# EAGLE design BMS_Master_RevB3 (EAGLE 6.2)

## Sheet 1 of 4
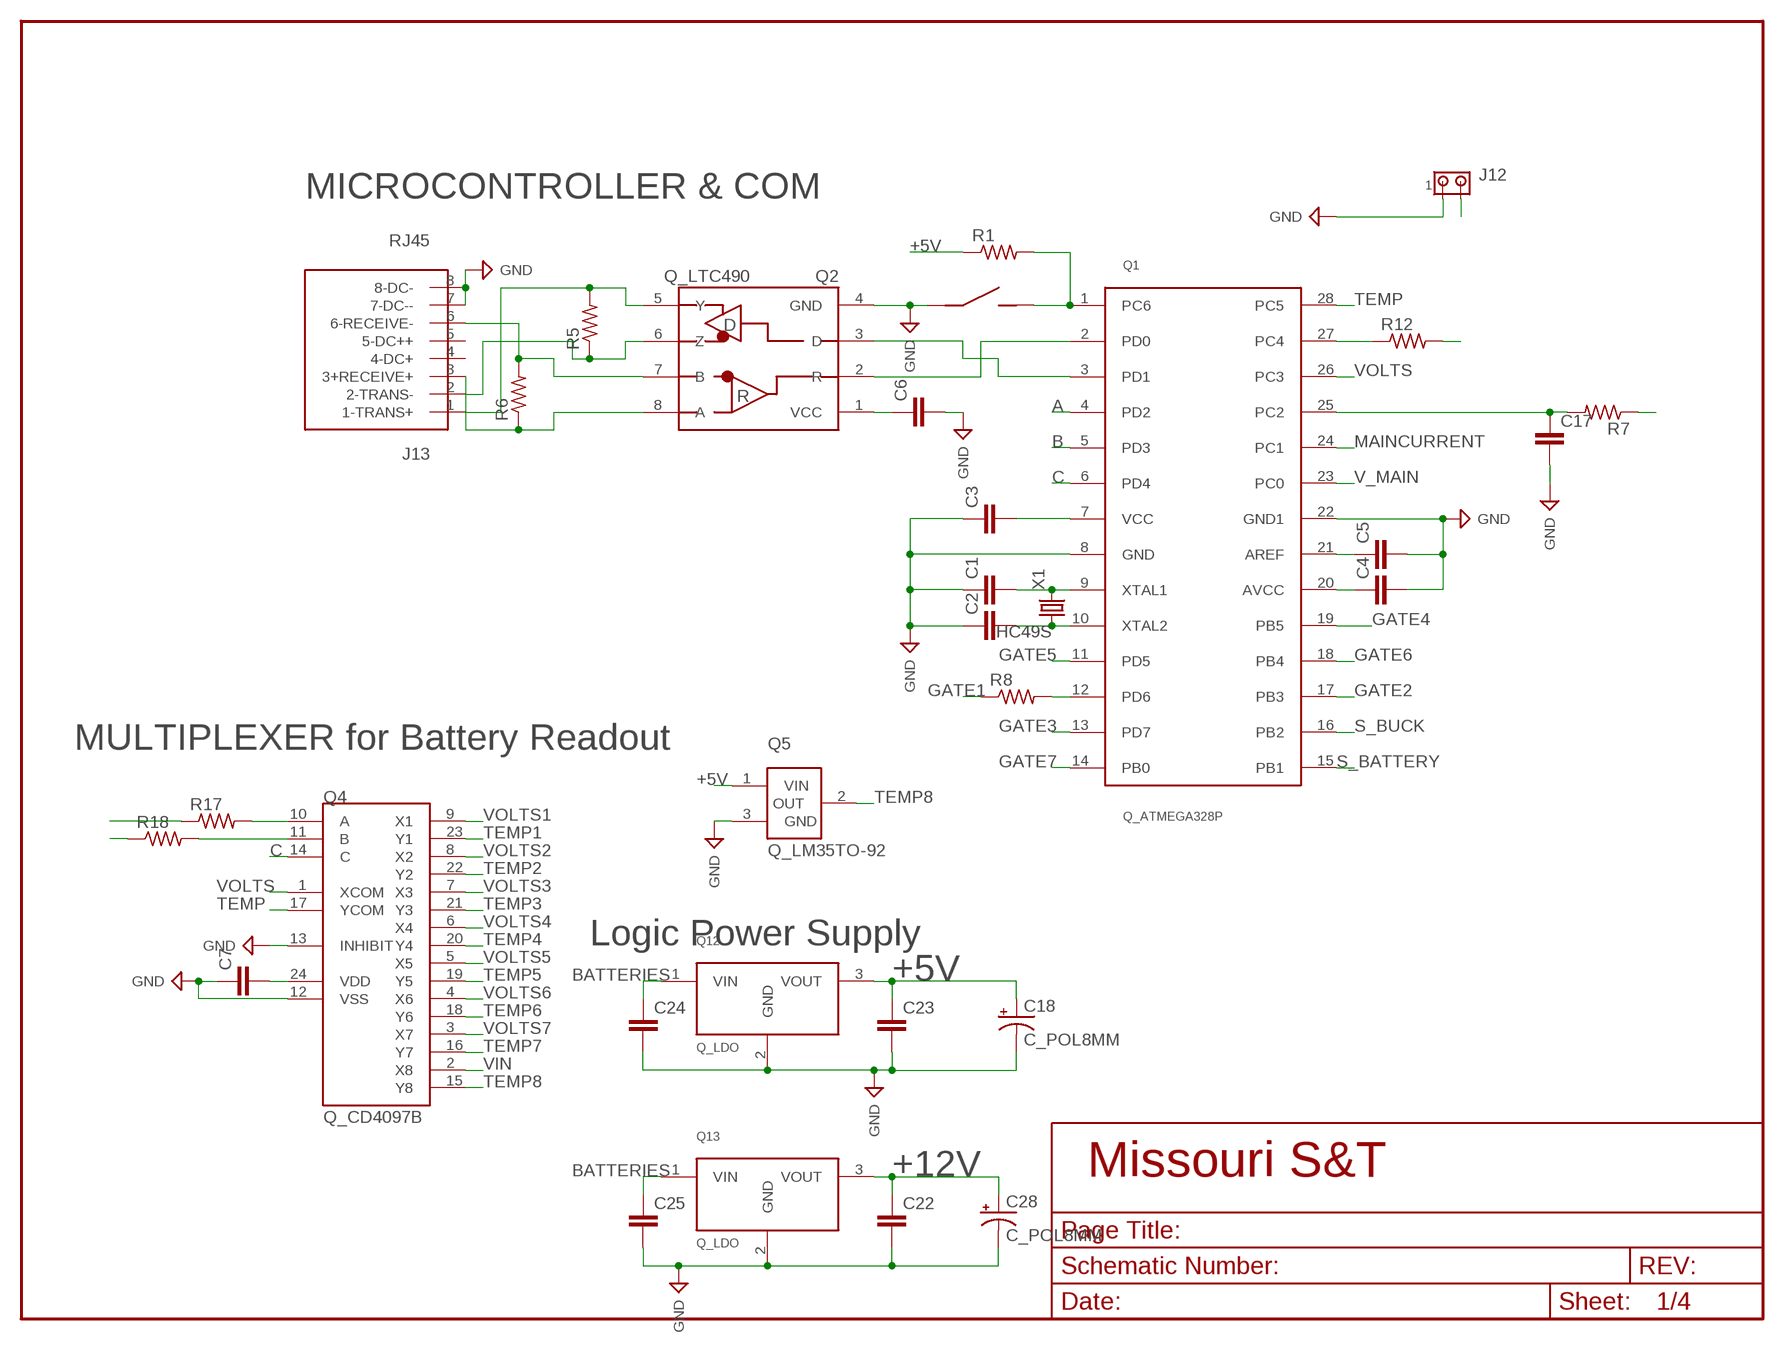
[diagram p0: schematic, sheet 1]

### Parts
C1  C_CAP_1206  [C_1206]
C2  C_CAP_1206  [C_1206]
C3  C_CAP_1206  [C_1206]
C4  C_CAP_1206  [C_1206]
C5  C_CAP_1206  [C_1206]
C6  C_CAP_1206  [C_1206]
C7  C_CAP_1206  [C_1206]
C17  C_CAP_1206  [C_1206]
C18  C_POL8MM  [C_8MM]
C22  C_CAP_1206  [C_1206]
C23  C_CAP_1206  [C_1206]
C24  C_CAP_1206  [C_1206]
C25  C_CAP_1206  [C_1206]
C28  C_POL8MM  [C_8MM]
J1  J_MC32857  [J_TOGGLE]
J12  J_MTA2P_100  [J_MTA100_2P]
J13  RJ45  [RJ45-CAT5E]
Q1  Q_ATMEGA328P  [DIP28]
Q2  Q_LTC490  [DIP8]
Q4  Q_CD4097B  Q_CD4067BRIGHT  [WDIP24]
Q5  Q_LM35TO-92  [TO-92-3]
Q12  Q_LDO  [TO-220]
Q13  Q_LDO  [TO-220]
R1  R_RES_1206  [R_1206]
R5  R_RES_1206  [R_1206]
R6  R_RES_1206  [R_1206]
R7  R_1/4W  [R_1/4W]
R8  R_1/4W  [R_1/4W]
R12  R_RES_0805  [R_0805]
R17  R_1/4W  [R_1/4W]
R18  R_1/4W  [R_1/4W]
X1  HC49S  X_HC49SCRYSTAL  [HC-49]

### Nets
+5V: C3.2 C4.1 C6.1 C7.2 C18.+ C23.1 Q1.7(VCC) Q1.20(AVCC) Q2.1(VCC) Q4.24(VDD) Q5.1(VIN) Q12.3(VOUT) R1.1 R12.2 ; also sheet 2,3
+12V: C22.1 C28.+ Q13.3(VOUT) ; also sheet 3,4
A: Q1.4(PD2) R17.1
B: Q1.5(PD3) R18.1
BATTERIES: C24.1 C25.1 Q12.1(VIN) Q13.1(VIN) ; also sheet 4
C: Q1.6(PD4) Q4.14(C)
CURRENT: R7.1 ; also sheet 3
GATE1: R8.1 ; also sheet 2
GATE2: Q1.17(PB3) ; also sheet 2
GATE3: Q1.13(PD7) ; also sheet 2
GATE4: Q1.19(PB5) ; also sheet 2
GATE5: Q1.11(PD5) ; also sheet 2
GATE6: Q1.18(PB4) ; also sheet 2
GATE7: Q1.14(PB0) ; also sheet 2
GND: C1.1 C2.1 C3.1 C4.2 C5.2 C6.2 C7.1 C17.2 C18.- C22.2 C23.2 C24.2 C25.2 C28.- J1.P$1 J12.1 J13.7(7-DC--) J13.8(8-DC-) Q1.8(GND) Q1.22(GND1) Q2.4(GND) Q4.12(VSS) Q4.13(INHIBIT) Q5.3(GND) Q12.2(GND) Q13.2(GND) ; supply symbol labelled SUP_GND ; also sheet 2,3,4
MAINCURRENT: Q1.24(PC1) ; also sheet 4
N$2: C2.2 Q1.10(XTAL2) X1.P$1
N$3: C1.2 Q1.9(XTAL1) X1.P$2
N$5: Q4.10(A) R17.2
N$6: C5.1 Q1.21(AREF)
N$7: Q4.11(B) R18.2
N$8: J1.P$2 Q1.1(PC6) R1.2
N$15: C17.1 Q1.25(PC2) R7.2
N$16: Q1.12(PD6) R8.2
N$21: Q1.2(PD0) Q2.2(R)
N$22: Q1.3(PD1) Q2.3(D)
N$32: J13.1(1-TRANS+) Q2.5(Y) R5.2
N$33: J13.2(2-TRANS-) Q2.6(Z) R5.1
N$36: J13.6(6-RECEIVE-) Q2.7(B) R6.2
N$37: J13.3(3+RECEIVE+) Q2.8(A) R6.1
PANIC: J12.2 Q1.27(PC4) R12.1
S_BATTERY: Q1.15(PB1) ; also sheet 4
S_BUCK: Q1.16(PB2) ; also sheet 3
TEMP: Q1.28(PC5) Q4.17(YCOM)
TEMP1: Q4.23(Y1) ; also sheet 2
TEMP2: Q4.22(Y2) ; also sheet 2
TEMP3: Q4.21(Y3) ; also sheet 2
TEMP4: Q4.20(Y4) ; also sheet 2
TEMP5: Q4.19(Y5) ; also sheet 2
TEMP6: Q4.18(Y6) ; also sheet 2
TEMP7: Q4.16(Y7) ; also sheet 2
TEMP8: Q4.15(Y8) Q5.2(OUT)
V_MAIN: Q1.23(PC0) ; also sheet 3
VIN: Q4.2(X8) ; also sheet 3
VOLTS: Q1.26(PC3) Q4.1(XCOM)
VOLTS1: Q4.9(X1) ; also sheet 2
VOLTS2: Q4.8(X2) ; also sheet 2
VOLTS3: Q4.7(X3) ; also sheet 2
VOLTS4: Q4.6(X4) ; also sheet 2
VOLTS5: Q4.5(X5) ; also sheet 2
VOLTS6: Q4.4(X6) ; also sheet 2
VOLTS7: Q4.3(X7) ; also sheet 2
Unconnected: J13.4(4-DC+) J13.5(5-DC++)

### Notes on the sheet
- MICROCONTROLLER & COM
- MULTIPLEXER for Battery Readout
- Logic Power Supply

## Sheet 2 of 4
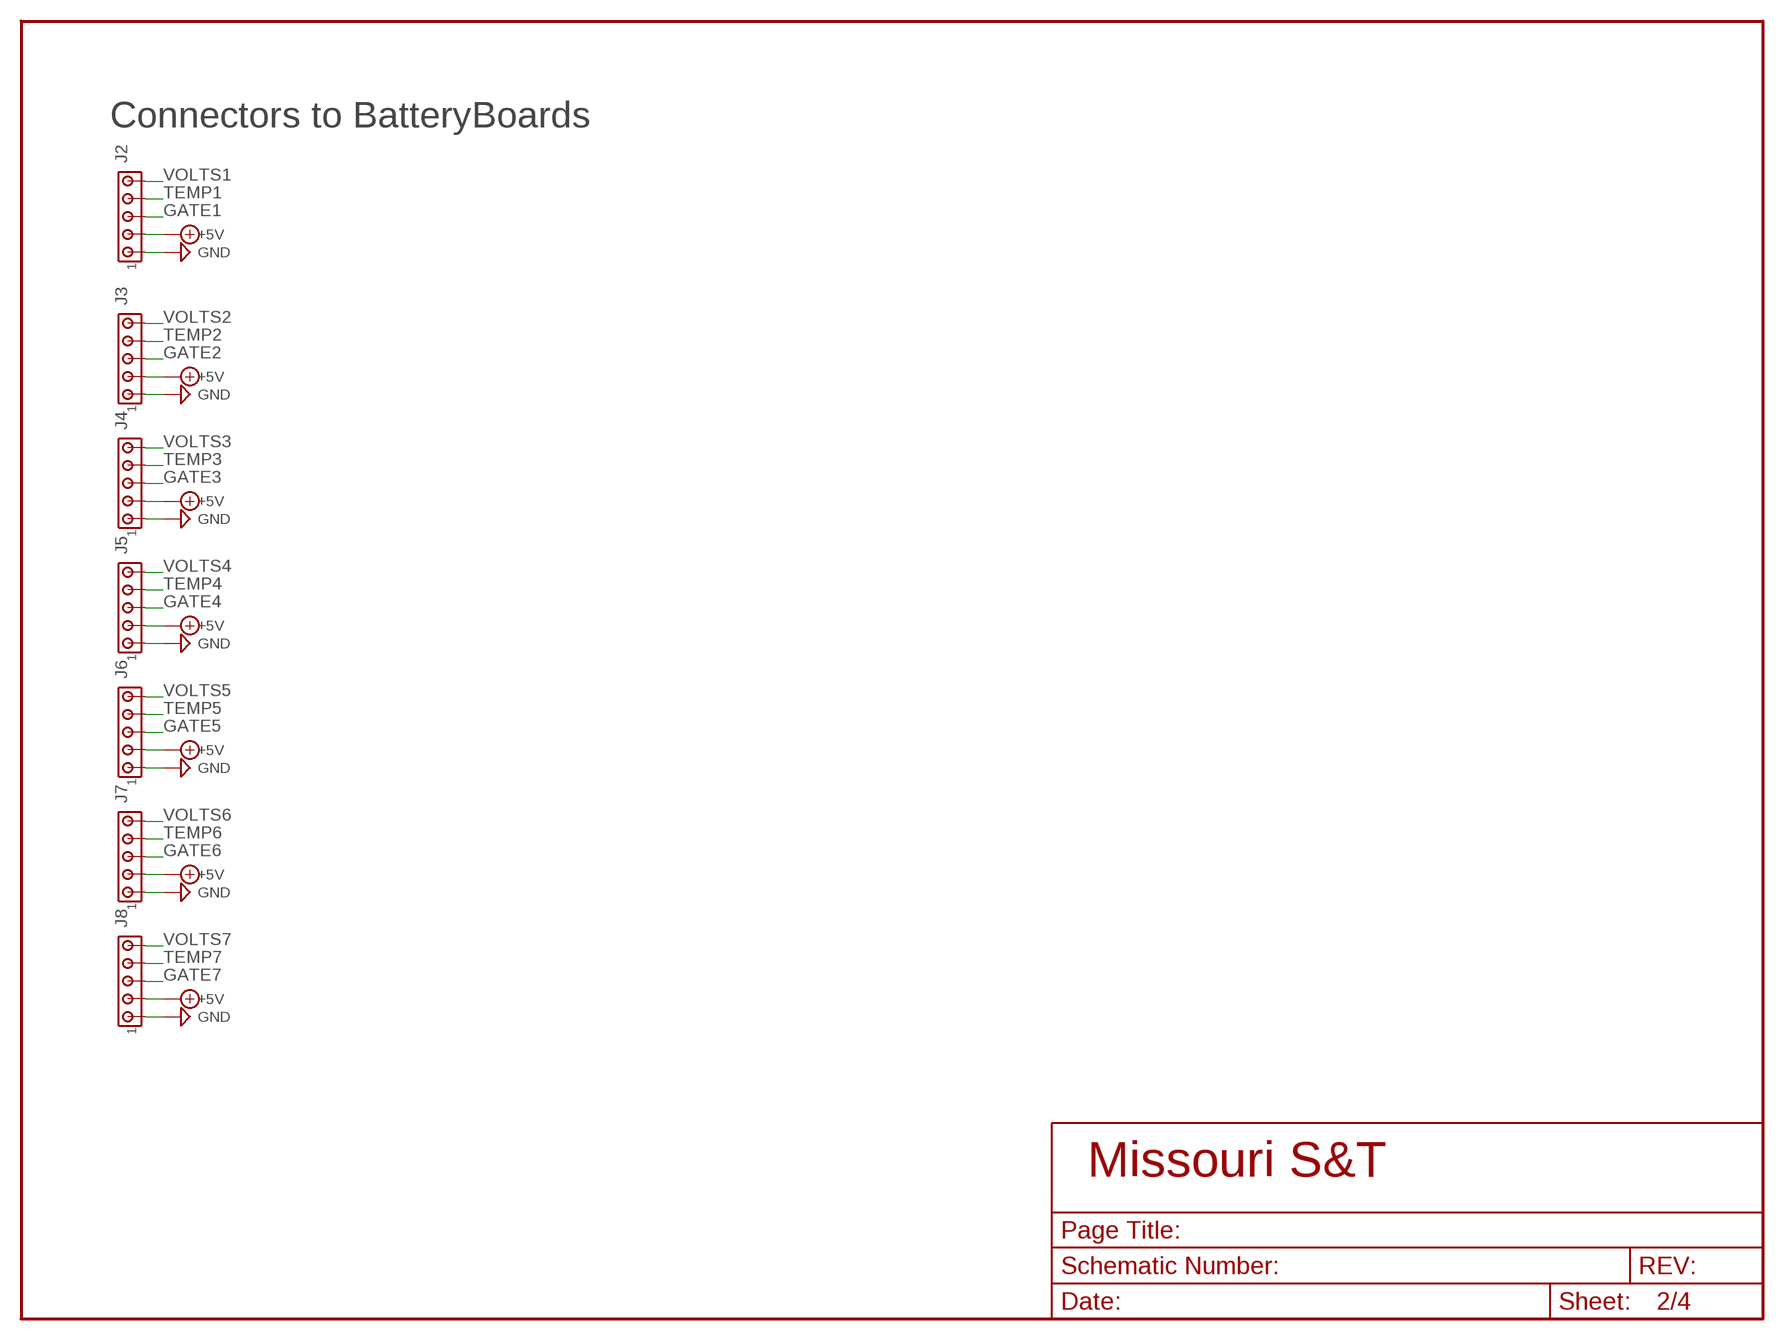
[diagram p1: schematic, sheet 2]

### Parts
J2  J_MTA5P_100  [J_MTA100_5P]
J3  J_MTA5P_100  [J_MTA100_5P]
J4  J_MTA5P_100  [J_MTA100_5P]
J5  J_MTA5P_100  [J_MTA100_5P]
J6  J_MTA5P_100  [J_MTA100_5P]
J7  J_MTA5P_100  [J_MTA100_5P]
J8  J_MTA5P_100  [J_MTA100_5P]

### Nets
+5V: J2.2 J3.2 J4.2 J5.2 J6.2 J7.2 J8.2 ; supply symbol labelled SUP_+5V ; also sheet 1,3
GATE1: J2.3 ; also sheet 1
GATE2: J3.3 ; also sheet 1
GATE3: J4.3 ; also sheet 1
GATE4: J5.3 ; also sheet 1
GATE5: J6.3 ; also sheet 1
GATE6: J7.3 ; also sheet 1
GATE7: J8.3 ; also sheet 1
GND: J2.1 J3.1 J4.1 J5.1 J6.1 J7.1 J8.1 ; supply symbol labelled SUP_GND ; also sheet 1,3,4
TEMP1: J2.4 ; also sheet 1
TEMP2: J3.4 ; also sheet 1
TEMP3: J4.4 ; also sheet 1
TEMP4: J5.4 ; also sheet 1
TEMP5: J6.4 ; also sheet 1
TEMP6: J7.4 ; also sheet 1
TEMP7: J8.4 ; also sheet 1
VOLTS1: J2.5 ; also sheet 1
VOLTS2: J3.5 ; also sheet 1
VOLTS3: J4.5 ; also sheet 1
VOLTS4: J5.5 ; also sheet 1
VOLTS5: J6.5 ; also sheet 1
VOLTS6: J7.5 ; also sheet 1
VOLTS7: J8.5 ; also sheet 1

### Notes on the sheet
- Connectors to BatteryBoards

## Sheet 3 of 4
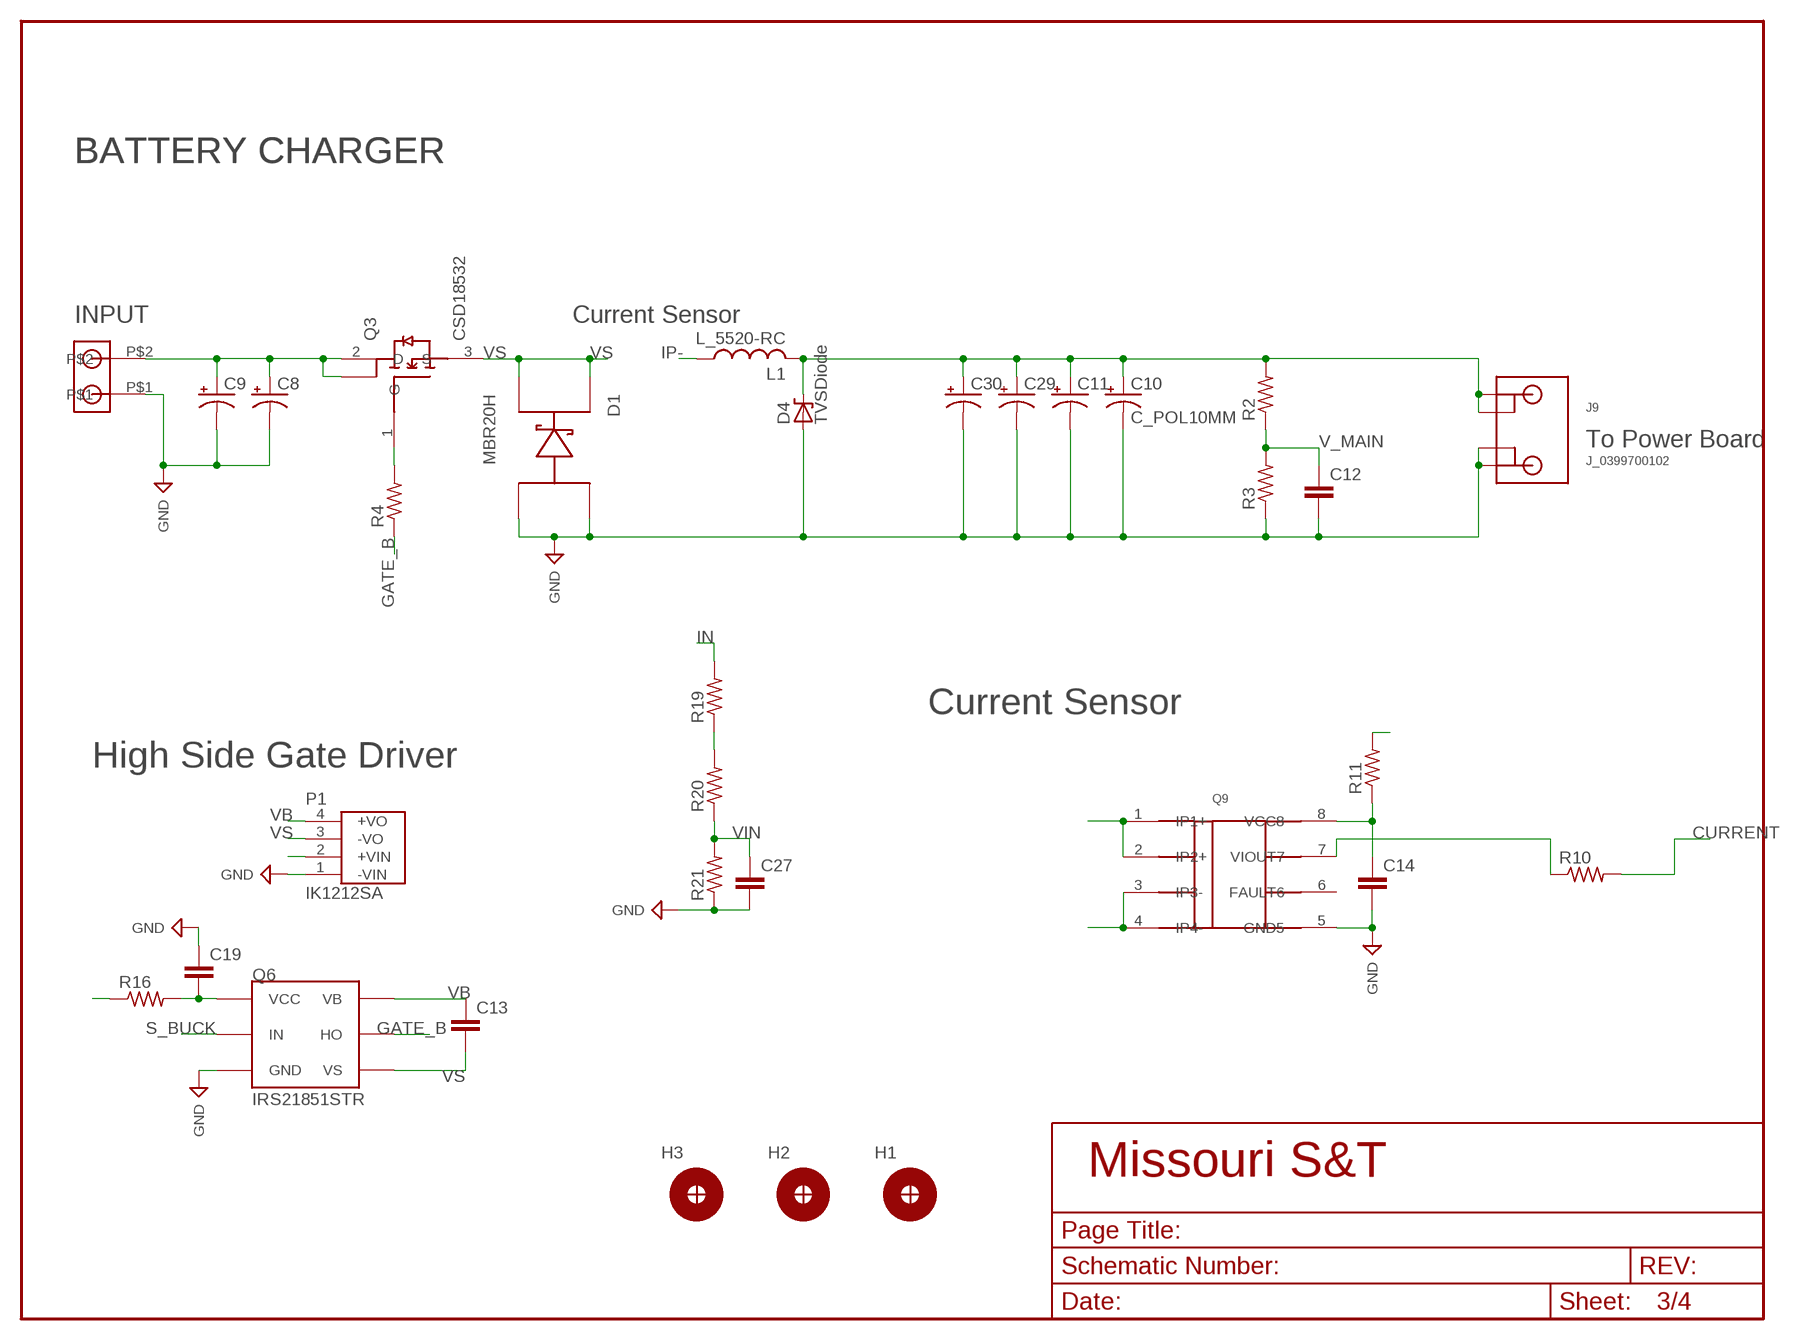
[diagram p2: schematic, sheet 3]

### Parts
C8  C_POL10MM  [C_10MM]
C9  C_POL10MM  [C_10MM]
C10  C_POL10MM  [C_10MM]
C11  C_POL10MM  [C_10MM]
C12  C_CAP_1206  [C_1206]
C13  C_CAP_1206  [C_1206]
C14  C_CAP_1206  [C_1206]
C19  C_CAP_1206  [C_1206]
C27  C_CAP_1206  [C_1206]
C29  C_POL10MM  [C_10MM]
C30  C_POL10MM  [C_10MM]
D1  MBR20H  D_MBR20H150CTG  [TO-220-FLAT]
D4  TVSDiode  D_1.5KE480A_D3.5MM_LS15.24MM  [DIODE_D3.5MM_LS15.24MM]
H1  H_MNTHOLE_#6  [H_MNTHOLE_#6]
H2  H_MNTHOLE_#6  [H_MNTHOLE_#6]
H3  H_MNTHOLE_#6  [H_MNTHOLE_#6]
J9  J_0399700102  [J_2CONHC]
J10  J_1546074-2  [THERM_BLOCK_2]
L1  L_5520-RC  [L_5520-RC]
P1  IK1212SA  TME1215S  [TME1215S]
Q3  CSD18532  Q_CSD18532KCSPCB  [TO-220-FLAT]
Q6  IRS21851STR  Q_IRS21851STR  [SOIC8]
Q9  Q_SO8ACS711  [Q_SO8]
R2  R_1/4W  [R_1/4W]
R3  R_RES_1206  [R_1206]
R4  R_RES_1206  [R_1206]
R10  R_1/4W  [R_1/4W]
R11  R_1/4W  [R_1/4W]
R16  R_1/4W  [R_1/4W]
R19  R_1/4W  [R_1/4W]
R20  R_1/4W  [R_1/4W]
R21  R_RES_1206  [R_1206]

### Nets
+5V: R11.2 ; also sheet 1,2
+5V1: C14.1 Q9.8(VCC8) R11.1 ; also sheet 4
+12V: R16.1 ; also sheet 1,4
+12V1: C19.2 P1.2(+VIN) Q6.1(VCC) R16.2
CURRENT: R10.2 ; also sheet 1
GATE_B: Q6.7(HO) R4.1
GND: C8.P$2(-) C9.P$2(-) C10.P$2(-) C11.P$2(-) C12.2 C14.2 C19.1 C27.2 C29.P$2(-) C30.P$2(-) D1.1(A1) D1.3(A2) D4.A J9.PIN2-1(2-1) J9.PIN2-2(2-2) J10.P$1 P1.1(-VIN) Q6.4(GND) Q9.5(GND5) R3.1 R21.1 ; supply symbol labelled SUP_GND ; also sheet 1,2,4
IN: C8.P$1(+) C9.P$1(+) J10.P$2 Q3.2(D) Q3.4 R19.2
IP-: L1.1 Q9.1(IP1+) Q9.2(IP2+)
MAIN: C10.P$1(+) C11.P$1(+) C29.P$1(+) C30.P$1(+) D4.C(K) J9.PIN1-1(1-1) J9.PIN1-2(1-2) L1.2 R2.2 ; also sheet 4
N$9: Q9.7(VIOUT7) R10.1
N$11: R19.1 R20.2
N$31: Q3.1(G) R4.2
S_BUCK: Q6.2(IN) ; also sheet 1
V_MAIN: C12.1 R2.1 R3.2 ; also sheet 1
VB: C13.1 P1.4(+VO) Q6.8(VB)
VIN: C27.1 R20.1 R21.2 ; also sheet 1
VS: C13.2 D1.2(C1) D1.4(C2) P1.3(-VO) Q3.3(S) Q6.6(VS) Q9.3(IP3-) Q9.4(IP4-)
Unconnected: H1.1 H2.1 H3.1 Q9.6(FAULT6)

### Notes on the sheet
- BATTERY CHARGER | BATTERY CHARGER
- INPUT | Current Sensor
- To Power Board
- Current Sensor
- High Side Gate Driver

## Sheet 4 of 4
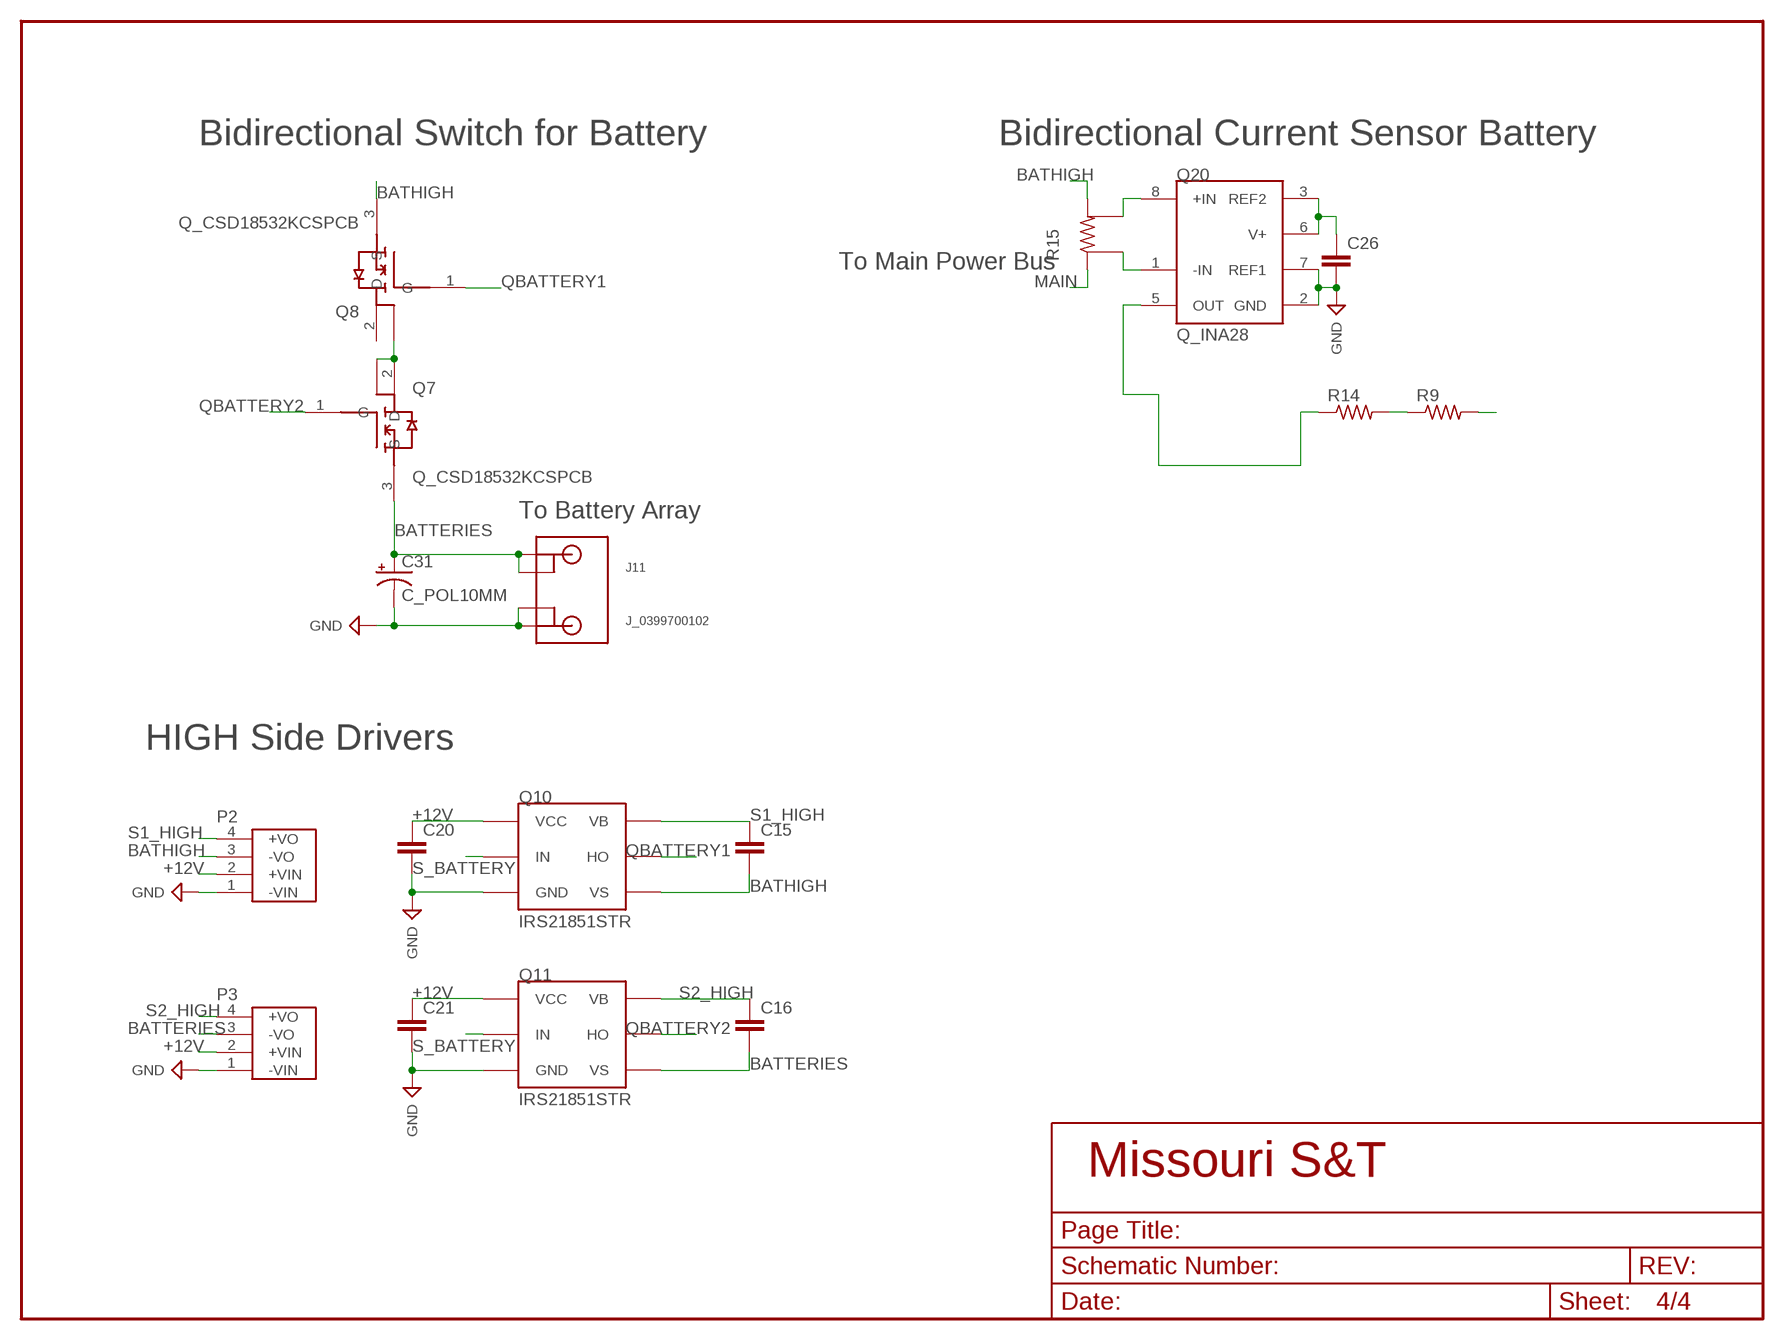
[diagram p3: schematic, sheet 4]

### Parts
C15  C_CAP_1206  [C_1206]
C16  C_CAP_1206  [C_1206]
C20  C_CAP_1206  [C_1206]
C21  C_CAP_1206  [C_1206]
C26  C_CAP_1206  [C_1206]
C31  C_POL10MM  [C_10MM]
J11  J_0399700102  [J_2CONHC]
P2  TME1215S  [TME1215S]
P3  TME1215S  [TME1215S]
Q7  Q_CSD18532KCSPCB  [TO-220-FLAT]
Q8  Q_CSD18532KCSPCB  [TO-220-FLAT]
Q10  IRS21851STR  Q_IRS21851STR  [SOIC8]
Q11  IRS21851STR  Q_IRS21851STR  [SOIC8]
Q20  Q_INA28  [SOIC8]
R9  R_1/4W  [R_1/4W]
R14  R_1/4W  [R_1/4W]
R15  R_FC4L110R001JER  [R_FC4L]

### Nets
+5V1: C26.1 Q20.3(REF2) Q20.6(V+) ; also sheet 3
+12V: C20.1 C21.1 P2.2(+VIN) P3.2(+VIN) Q10.1(VCC) Q11.1(VCC) ; also sheet 1,3
BATHIGH: C15.2 P2.3(-VO) Q8.3(S) Q10.6(VS) R15.2
BATTERIES: C16.2 C31.P$1(+) J11.PIN1-1(1-1) J11.PIN1-2(1-2) P3.3(-VO) Q7.3(S) Q11.6(VS) ; also sheet 1
GND: C20.2 C21.2 C26.2 C31.P$2(-) J11.PIN2-1(2-1) J11.PIN2-2(2-2) P2.1(-VIN) P3.1(-VIN) Q10.4(GND) Q11.4(GND) Q20.2(GND) Q20.7(REF1) ; supply symbol labelled SUP_GND ; also sheet 1,2,3
INT_BAT: Q7.2(D) Q7.4 Q8.4
MAIN: R15.1 ; also sheet 3
MAINCURRENT: R9.2 ; also sheet 1
N$4: Q20.5(OUT) R14.1
N$12: Q20.8(+IN) R15.SENSE2
N$13: Q20.1(-IN) R15.SENSE1
N$14: R9.1 R14.2
QBATTERY1: Q8.1(G) Q10.7(HO)
QBATTERY2: Q7.1(G) Q11.7(HO)
S1_HIGH: C15.1 P2.4(+VO) Q10.8(VB)
S2_HIGH: C16.1 P3.4(+VO) Q11.8(VB)
S_BATTERY: Q10.2(IN) Q11.2(IN) ; also sheet 1
Unconnected: Q8.2(D)

### Notes on the sheet
- Bidirectional Switch for Battery | Bidirectional Current Sensor Battery
- To Main Power Bus
- To Battery Array
- HIGH Side Drivers

## Library data of the parts
C1-C7 C12-C17 C19-C27 = Lib_Passive:C_CAP
C8-C11 C18 C28-C31 = PCB0M1:C_POL: Alum Elect. Cap with 10mm diameter, 5mm lead spacing and 0.7mm lead diameter
D1 = PCB0M1:D_MBR20H150CTG: 150V 20A Schottky Diode TO-220 Flat Mounted
D4 = Lib_Katlyn:D_1.5KE480A: Zener Diode
H1-H3 = Lib_TH:H_MNTHOLE
J1 = PCB0M1:J_MC32857: SWITCH, TACTILE, SPST-NO, 50mA, THD
J2-J8 = Lib_TH:J_MTA5P
J9 J11 = PCB0M1:J_0399700102: High Current Power Connector
J10 = PCB0M1:J_1546074-2
J12 = Lib_TH:J_MTA2P
J13 = PCB0M1:RJ45
L1 = PCB0M1:L_5520-RC: 100uH 10A Inductor
P1-P3 = SCC Fib:TME1215S
Q1 = PCB0M1:Q_ATMEGA328P: ATMEGA 328P in 28PIN PDIP package
Q2 = PCB0M1:Q_LTC490: IC, RS422-RS485 DRVR
Q3 Q7 Q8 = PCB0M1:Q_CSD18532KCS: 60V 100A N Channel MOSFET
Q4 = PCB0M1:Q_CD4067B: Differential 8:1 Multiplexer
Q5 = PCB0M1:Q_LM35: IC, TEMPERATURE SENSOR, 0.4°C, TO-92-3
Q6 Q10 Q11 = PCB0M1:Q_IRS21851STR: 4A 600V 130ns High Side Driver
Q9 = Lib_MPPT:Q_SO8
Q12 Q13 = PCB0M1:Q_LDO: LDO with fixed ouput voltage
Q20 = PCB0M1:Q_INA28: 10Khz Bidirectional Current Sense Amplifier
R1 R3 R12 R21 = Lib_Passive:R_RES
R2 R7-R11 R14 R16-R20 = Lib_TH:R
R4-R6 = Lib_Passive - Copy:R_RES
R15 = PCB0M1:R_FC4L110R001JER
X1 = PCB0M1:X_HC49SCRYSTAL: CRYSTAL METAL CAN, 16MHZ, 18PF, HC-49/US

## Board
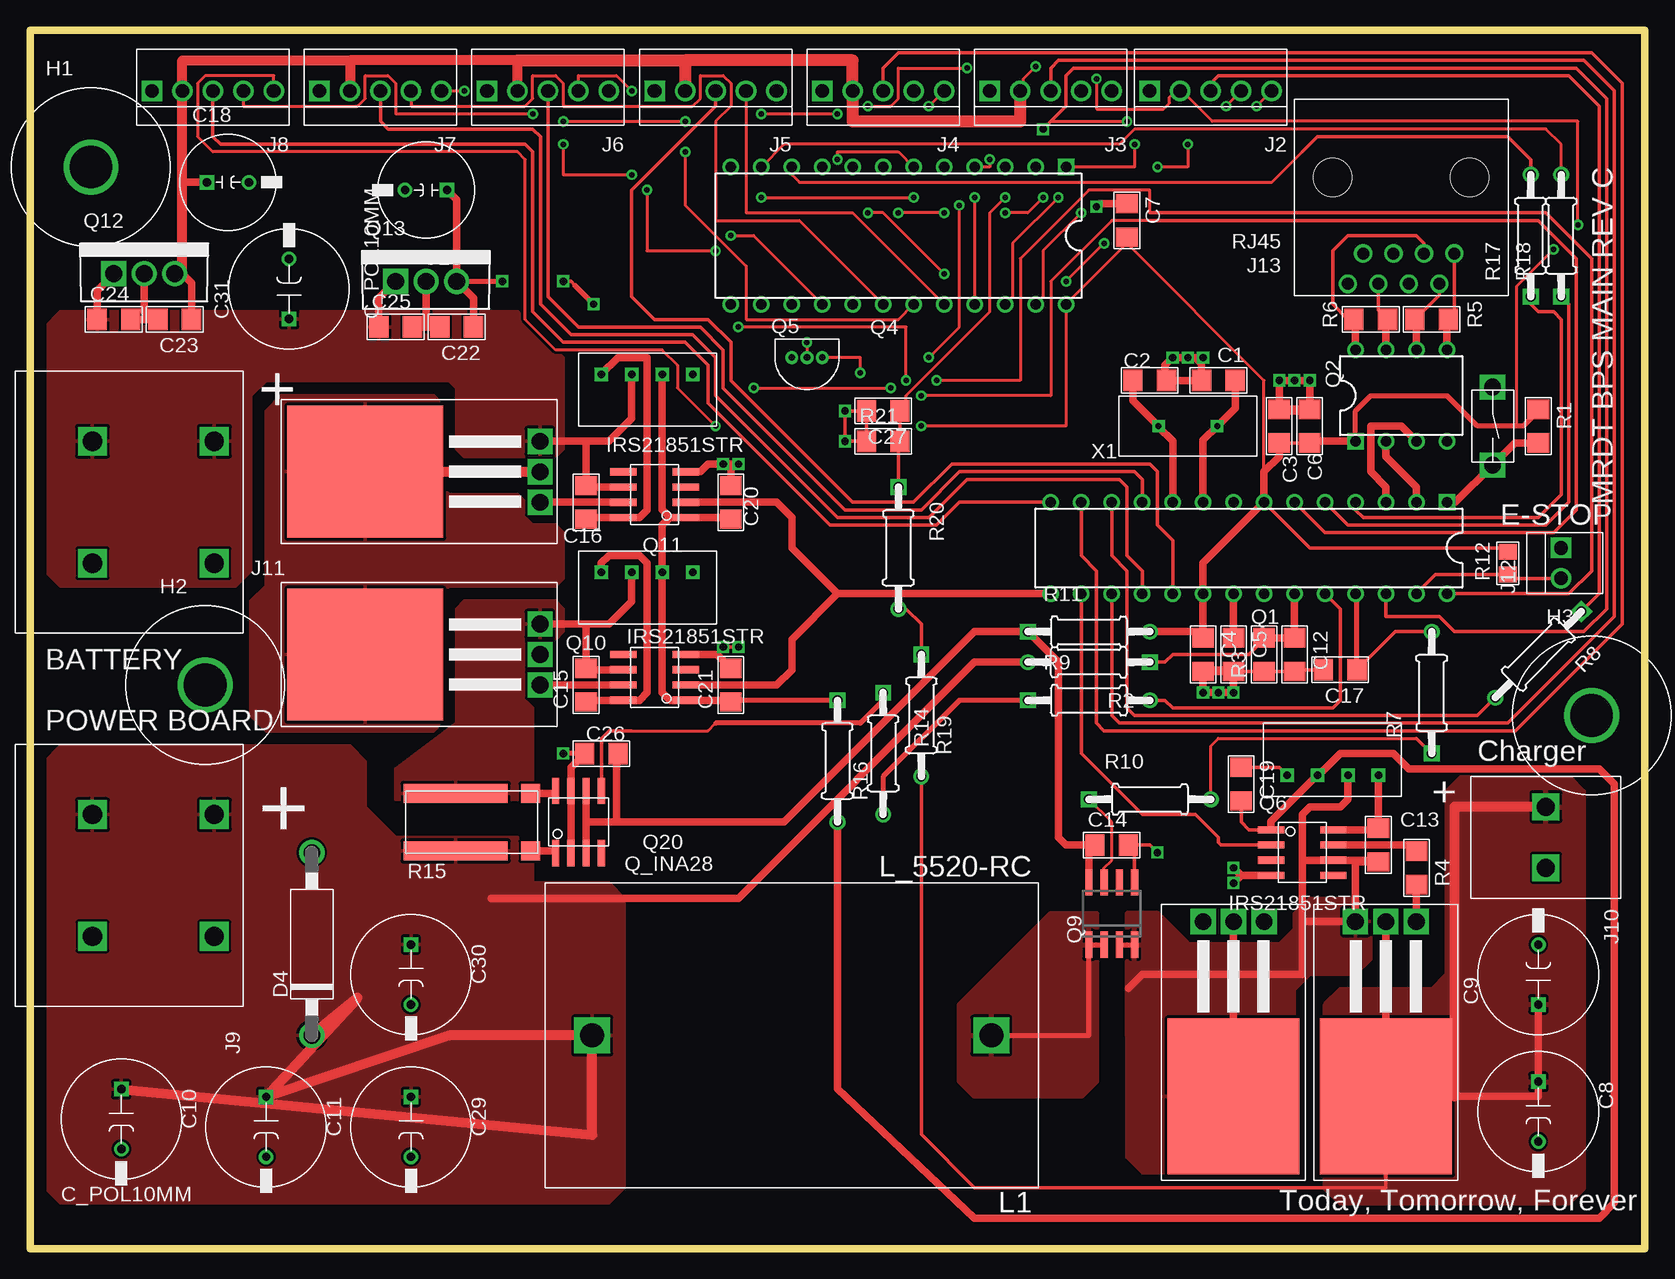
[diagram p4: board, top side]
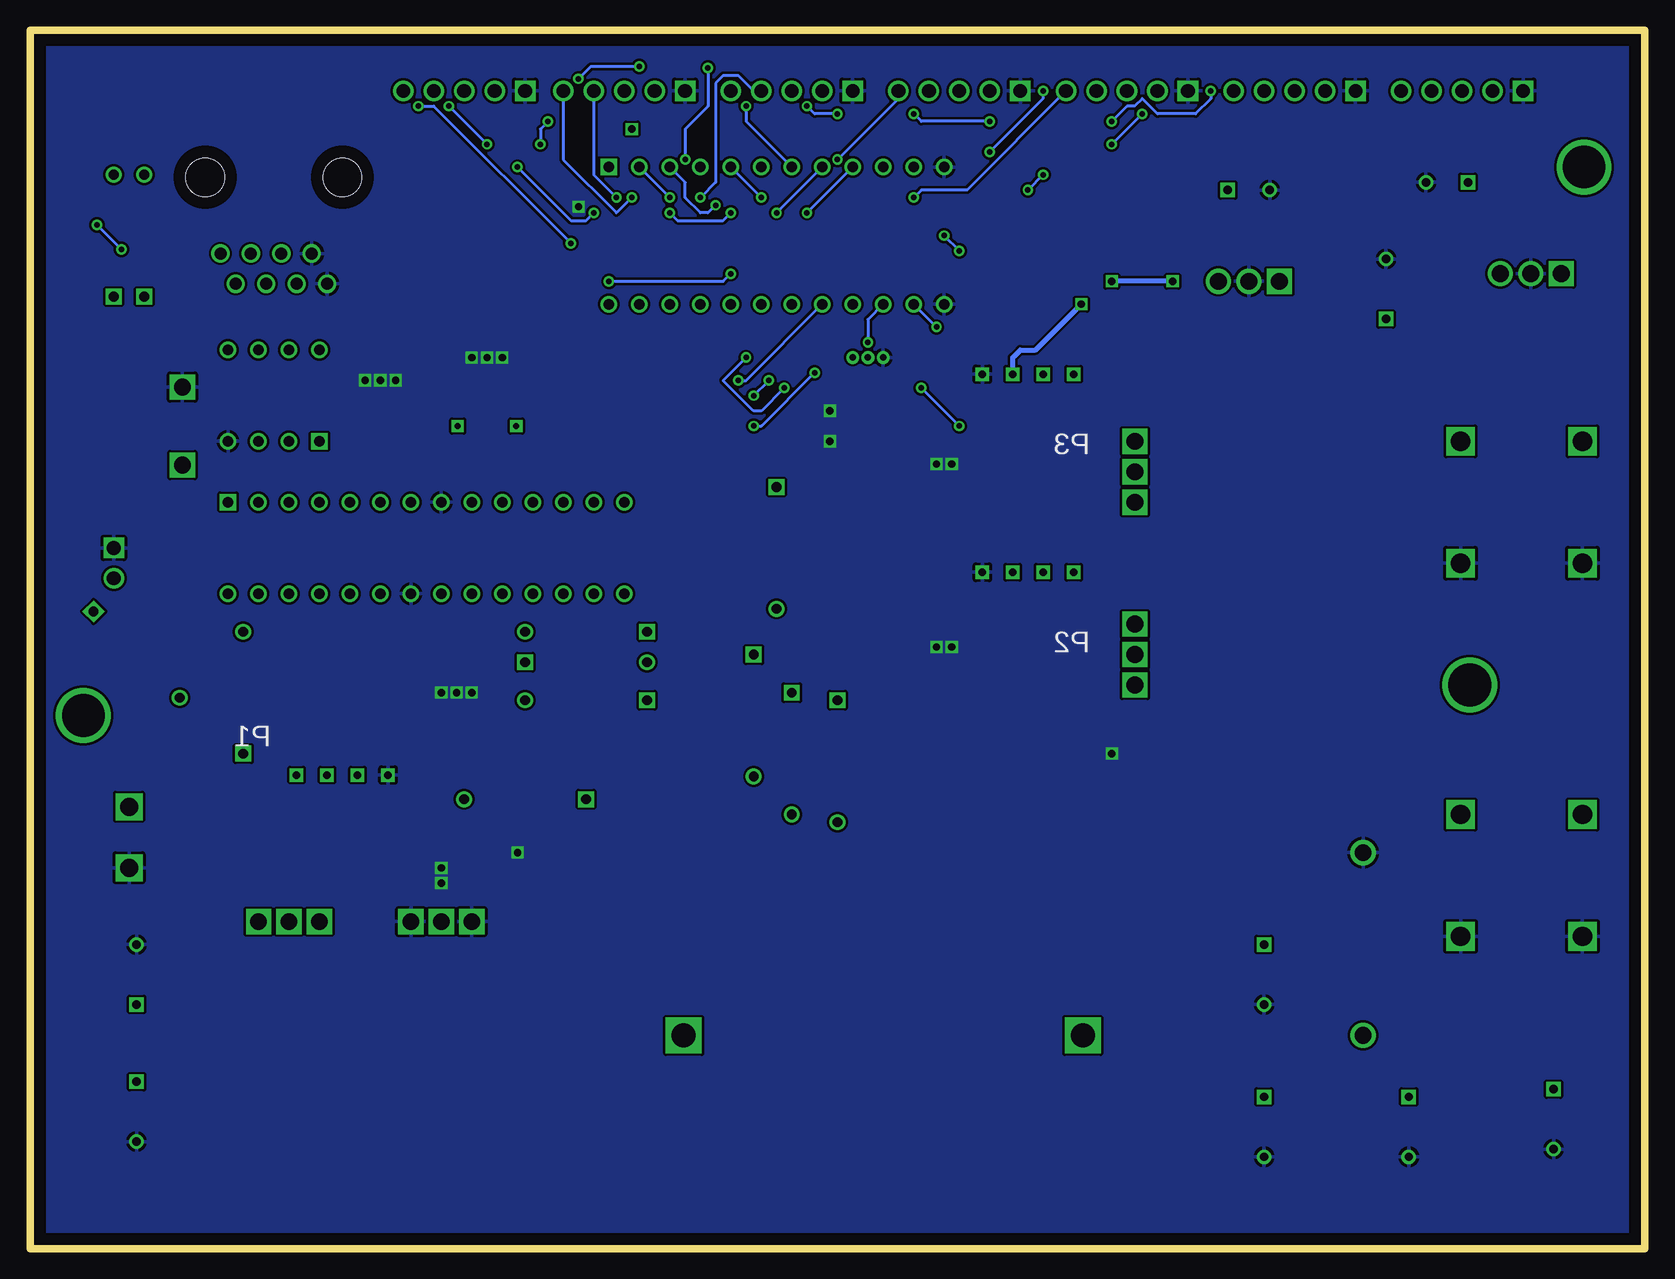
[diagram p5: board, bottom side, seen from below]

Size 134.62 x 101.6 mm. Coordinates in mm from the lower left corner, seen from the top.
Outline: 0,0 0,101.6 134.62,101.6 134.62,0 0,0
Copper layers (1*16): Top 0.035mm / dielectric 1.5mm / Bottom 0.035mm
Design rules: minimum track width 10mil, minimum drill 18mil, track to track 8mil, track to pad 8mil, pad to pad 8mil, via to via 8mil, smd to smd 8mil, copper to edge 40mil, drill to drill 8mil, minimum pad ring 10mil, minimum via ring 8mil, stop-mask expansion 4mil, vias tented up to drill 0mil, thermal gap 10mil

### Footprints (pad centres in the part's own frame; a part is rotated, then mirrored left to right if it is on the bottom)
C_1206 = smd 1.6 x 1.8: 1 -1.4,0; 2 1.4,0
C_10MM = drill 0.7 square: P$1 -2.5,0 | drill 0.7: P$2 2.5,0
C_8MM = drill 0.7 square: + -1.75,0 | drill 0.7: - 1.75,0
TO-220-FLAT = drill 1.4 square: 1 -2.54,-14.57; 2 0,-14.57; 3 2.54,-14.57 | smd 11 x 13: 4 0,0
DIODE_D3.5MM_LS15.24MM = drill 1.397: A 7.62,0; C -7.62,0
H_MNTHOLE_#6 = drill 3.556: 1 0,0
J_TOGGLE = drill 1.4 square: P$1 -3.25,0; P$2 3.25,0
J_MTA100_5P = drill 1.143 square: 1 5.08,0 | drill 1.143: 2 2.54,0; 3 0,0; 4 -2.54,0; 5 -5.08,0
J_2CONHC = drill 1.6 square: PIN1-1 -5.08,-3.05; PIN1-2 -5.08,7.11; PIN2-1 5.08,-3.05; PIN2-2 5.08,7.11
THERM_BLOCK_2 = drill 1.5 square: P$1 2.54,0; P$2 -2.54,0
J_MTA100_2P = drill 1.143 square: 1 1.27,0 | drill 1.143: 2 -1.27,0
RJ45-CAT5E = drill 1: 1 -4.445,4.655; 2 -3.175,7.195; 3 -1.905,4.655; 4 -0.635,7.195; 5 0.635,4.655; 6 1.905,7.195; 7 3.175,4.655; 8 4.445,7.195 | hole 3.2: 5.715,-1.695; -5.715,-1.695
L_5520-RC = drill 2 square: 1 -16.637,0; 2 16.637,0
TME1215S = drill 0.627 square: 1 9.52,4.325; 2 6.98,4.325; 3 4.44,4.325; 4 1.9,4.325
DIP28 = drill 0.864 square: 1 -16.51,-3.81 | drill 0.864: 2 -13.97,-3.81; 3 -11.43,-3.81; 4 -8.89,-3.81; 5 -6.35,-3.81; 6 -3.81,-3.81; 7 -1.27,-3.81; 8 1.27,-3.81; 9 3.81,-3.81; 10 6.35,-3.81; 11 8.89,-3.81; 12 11.43,-3.81; 13 13.97,-3.81; 14 16.51,-3.81; 15 16.51,3.81; 16 13.97,3.81; 17 11.43,3.81; 18 8.89,3.81; 19 6.35,3.81; 20 3.81,3.81; 21 1.27,3.81; 22 -1.27,3.81; 23 -3.81,3.81; 24 -6.35,3.81; 25 -8.89,3.81; 26 -11.43,3.81; 27 -13.97,3.81; 28 -16.51,3.81
DIP8 = drill 0.864 square: 1 -3.81,-3.81 | drill 0.864: 2 -1.27,-3.81; 3 1.27,-3.81; 4 3.81,-3.81; 5 3.81,3.81; 6 1.27,3.81; 7 -1.27,3.81; 8 -3.81,3.81
WDIP24 = drill 0.864 square: 1 -13.97,-5.715 | drill 0.864: 2 -11.43,-5.715; 3 -8.89,-5.715; 4 -6.35,-5.715; 5 -3.81,-5.715; 6 -1.27,-5.715; 7 1.27,-5.715; 8 3.81,-5.715; 9 6.35,-5.715; 10 8.89,-5.715; 11 11.43,-5.715; 12 13.97,-5.715; 13 13.97,5.715; 14 11.43,5.715; 15 8.89,5.715; 16 6.35,5.715; 17 3.81,5.715; 18 1.27,5.715; 19 -1.27,5.715; 20 -3.81,5.715; 21 -6.35,5.715; 22 -8.89,5.715; 23 -11.43,5.715; 24 -13.97,5.715
TO-92-3 = drill 0.55: 1 1.27,0; 2 0,0; 3 -1.27,0
SOIC8 = smd 2.2 x 0.6: 1 -2.6,1.905; 2 -2.6,0.635; 3 -2.6,-0.635; 4 -2.6,-1.905; 5 2.6,-1.905; 6 2.6,-0.635; 7 2.6,0.635; 8 2.6,1.905
Q_SO8 = smd 2.2 x 0.6: 1 -2.6,1.905; 2 -2.6,0.635; 3 -2.6,-0.635; 4 -2.6,-1.905; 5 2.6,-1.905; 6 2.6,-0.635; 7 2.6,0.635; 8 2.6,1.905
TO-220 = drill 1.397 square: 1 -2.54,0 | drill 1.397: 2 0,0; 3 2.54,0
R_1206 = smd 1.6 x 1.8: 1 -1.4,0; 2 1.4,0
R_1/4W = drill 0.813 square: 1 -5.08,0 | drill 0.813: 2 5.08,0
R_0805 = smd 1.3 x 1.5: 1 -0.95,0; 2 0.95,0
R_FC4L = smd 1.6 x 8.7: 1 2.4,-1.35; 2 -2.4,-1.35 | smd 1.6 x 1.6: SENSE1 2.4,4.9; SENSE2 -2.4,4.9
HC-49 = drill 0.5 square: P$1 -2.44,0; P$2 2.44,0

### Placement (x,y rotation side)
C1  99.06,72.39 0 top
C2  93.34,72.39 180 top
C3  104.14,68.58 270 top
C4  97.79,49.53 270 top
C5  100.33,49.53 270 top
C6  106.68,68.58 90 top
C7  91.44,85.72 270 top
C8  125.73,11.43 270 top
C9  125.73,22.86 90 top
C10  7.62,10.79 270 top
C11  19.68,10.16 270 top
C12  105.41,49.53 270 top
C13  112.4,33.66 270 top
C14  90.17,33.66 0 top
C15  46.35,46.99 90 top
C16  46.35,62.23 90 top
C17  109.22,48.26 180 top
C18  16.51,88.9 0 top
C19  100.97,38.73 270 top
C20  58.42,62.23 90 top
C21  58.42,46.99 90 top
C22  35.56,76.83 180 top
C23  12.07,77.47 180 top
C24  6.99,77.47 0 top
C25  30.48,76.83 0 top
C26  47.62,41.27 180 top
C27  71.12,69.85 180 top
C28  33.02,88.27 180 top
C29  31.75,10.16 270 top
C30  31.75,22.86 270 top
C31  21.59,80.01 90 top
D1  100.33,12.7 180 top
D4  23.5,25.4 90 top
H1  5.08,90.17 0 top
H2  14.61,46.99 0 top
H3  130.18,44.45 0 top
J1  121.92,68.58 270 top
J2  98.43,96.52 180 top
J3  85.09,96.52 180 top
J4  71.12,96.52 180 top
J5  57.15,96.52 180 top
J6  43.18,96.52 180 top
J7  29.21,96.52 180 top
J8  15.24,96.52 180 top
J9  8.26,31.11 270 top
J10  126.37,34.29 270 top
J11  8.26,62.23 270 top
J12  127.64,57.15 90 top
J13  114.3,87.63 180 top
L1  63.5,17.78 180 top
P1  114.3,43.81 180 top
P2  45.72,52.07 0 top
P3  45.72,68.58 0 top
Q1  101.6,58.42 180 top
Q2  114.3,71.12 0 top
Q3  113.03,12.7 180 top
Q4  72.39,84.45 180 top
Q5  64.77,74.3 0 top
Q6  106.05,33.02 0 top
Q7  27.94,64.77 90 top
Q8  27.94,49.53 90 top
Q9  90.17,27.94 90 top
Q10  52.07,47.62 180 top
Q11  52.07,62.87 180 top
Q12  9.53,81.28 0 top
Q13  33.02,80.64 0 top
Q20  45.72,35.56 90 top
R1  125.73,68.58 270 top
R2  88.27,48.9 180 top
R3  102.87,49.53 90 top
R4  115.57,31.75 270 top
R5  116.84,77.47 0 top
R6  111.76,77.47 0 top
R7  116.84,46.35 90 top
R8  125.73,49.53 225 top
R9  88.27,45.72 0 top
R10  93.34,37.47 0 top
R11  88.27,51.44 0 top
R12  123.19,57.15 90 top
R14  71.12,41.27 270 top
R15  36.83,35.56 270 top
R16  67.31,40.64 270 top
R17  125.09,84.45 90 top
R18  127.64,84.45 90 top
R19  74.3,44.45 270 top
R20  72.39,58.42 270 top
R21  71.12,67.31 0 top
X1  96.52,68.58 0 top

### Tracks (layer width: path | path; a pad name or v marks a point on that pad's centre or on a via)
+5V  (via drill 0.46)
  Top 0.254: v129.03,85.34 129.03,93.98 98.55,93.98 96.01,96.52 J2.2 95.5,96.52 95,96.01 95,95.5 94.49,95 88.9,95 v88.9,97.54 | v127,83.31 123.95,80.26 123.95,68.58 | v83.82,98.55 82.8,97.54 82.8,96.52 J3.2 | 91.44,83.82 Q4.24 86.36,68.58 v74.3,68.58 | 91.44,83.82 102.87,72.39 102.87,64.77 | 91.44,83.82 C7.2 | Q5.1 69.22,74.3 v69.22,73.03
  Top 0.305: C3.2 C6.1 | Q1.7 106.68,58.42 123.06,58.42 R12.2
  Top 0.406: Q2.1 110.49,69.85 111.76,71.12 118.11,71.12 120.65,68.58 123.95,68.58 124.46,68.58 125.73,69.85 R1.1
  Top 0.61: 97.79,51.44 C4.1 97.29,51.44 | 97.79,51.44 Q1.20 97.79,57.15 Q1.7 102.87,64.77 104.14,66.04 C3.2 | Q2.1 106.81,67.31 C6.1 | 12.7,81.28 13.46,80.52 C23.1 13.97,76.97 | R11.2 97.79,51.44 | C18.+ 12.7,88.9
  Top 0.813: Q12.3 12.7,81.28 12.7,88.9 J8.2 12.7,99.06 26.67,99.06 | 26.67,99.06 J7.2 | 26.67,99.06 40.64,99.06 J6.2
  Top 1.016: 40.64,99.06 54.61,99.06 | 54.61,99.06 J5.2 | 54.61,99.06 68.58,99.06 J4.2 68.58,93.98 82.55,93.98 J3.2
  Bottom 0.254: v127,83.31 v129.03,85.34 | v88.9,97.54 87.88,98.55 v83.82,98.55 | v69.22,73.03 73.66,68.58 v74.3,68.58
+5V1
  Top 0.61: 46.35,35.56 Q20.3 | 48.89,35.56 62.86,35.56 78.74,51.44 R11.1 85.73,48.9 85.73,34.29 86.36,33.66 C14.1 88.27,33.15 Q9.8 | Q20.6 46.35,35.56 | 46.35,35.56 48.89,35.56 | 48.89,35.56 48.89,41.15 C26.1
+12V  (via drill 0.6)
  Top 0.305: v44.45,80.64 45.09,80.64 45.4,80.33
  Top 0.406: v46.99,78.74 45.4,80.33 | Q13.3 v39.37,80.64 | R16.1 58.55,45.72 C21.1
  Top 0.61: C20.1 58.29,60.96 Q11.1 53.34,60.96 | C21.1 58.29,45.72 Q10.1 53.34,45.72 52.7,46.35 P2.2 52.7,60.33 53.34,60.96 | P3.2 52.7,61.6 53.34,60.96 | C22.1 36.96,79.25 Q13.3 35.56,87.47 C28.+
  Bottom 0.406: P3.2 52.7,74.3 52.07,74.93 50.8,74.93 v46.99,78.74 | v39.37,80.64 v44.45,80.64
+12V1
  Top 0.305: C19.2 100.97,35.56 101.6,34.92 Q6.1
  Top 0.61: R16.2 67.31,13.34 78.74,2.54 130.81,2.54 132.08,3.81 132.08,38.73 130.81,40.01 114.94,40.01 113.67,41.27 109.22,41.27 107.44,39.49 P1.2 103.45,35.62 Q6.1
A
  Top 0.305: Q1.4 110.49,61.59 111.12,60.96 125.73,60.96 127.64,62.87 127.64,77.47 127,78.11 125.73,78.11 125.09,78.74 R17.1
B
  Top 0.305: Q1.5 109.86,60.33 126.37,60.33 128.27,62.23 128.27,78.74 R18.1
BATHIGH
  Top 0.61: Q10.6 46.35,48.26 C15.2 46.35,52.07 | Q8.3 46.35,52.07 | 46.35,52.07 48.26,52.07 50.16,53.97 P2.3
  pour Top: 30.48,37.47 41.91,37.47 41.91,45.09 41.27,45.72 41.27,50.16 41.91,50.8 43.81,50.8 44.45,51.44 44.45,53.34 43.81,53.98 36.2,53.98 35.56,53.34 35.56,43.81 30.48,40.01
BATTERIES
  Top 0.254: C31.P$1 21.84,77.72 21.84,77.49
  Top 0.61: P3.3 50.16,69.21 48.26,67.31 46.35,67.31 | 46.35,67.31 Q7.3 | Q11.6 46.35,63.5 C16.2 46.35,67.31 | C24.1 5.58,79.88 Q12.1 | C25.1 29.08,79.25 Q13.1
  pour Top: 43.81,66.04 36.2,66.04 35.56,66.67 35.56,71.75 34.92,72.39 9.53,72.39 8.89,73.03 8.89,77.47 9.53,78.11 40.64,78.11 44.45,74.3 44.45,66.67
  pour Top: 20.96,78.11 2.54,78.11 1.27,76.83 1.27,56.52 2.54,55.24 17.14,55.24 18.41,56.52 18.41,71.12 19.68,72.39 20.96,72.39
C  (via drill 0.46)
  Top 0.254: v59.05,76.83 73.03,76.83 v73.03,72.39 | v74.3,71.12 85.09,71.12 85.09,80.64 90.17,85.72 93.98,85.72
  Top 0.305: Q1.6 107.95,59.69 127,59.69 128.91,61.59 128.91,82.55 125.73,85.72 93.98,85.72
  Bottom 0.254: v59.05,76.83 Q4.14 | v74.3,71.12 v73.03,72.39
CURRENT
  Top 0.254: R10.2 98.43,41.91 99.06,42.55 115.57,42.55
  Top 0.305: 115.57,42.55 R7.1
GATE1
  Top 0.305: J2.3 98.43,97.16 99.06,97.79 128.27,97.79 130.81,95.25 130.81,54.61 R8.1
GATE2
  Top 0.305: J3.3 85.09,98.42 85.73,99.06 129.54,99.06 132.08,96.52 132.08,52.7 123.19,43.81 90.81,43.81 90.17,44.45 Q1.17
GATE3
  Top 0.305: J4.3 71.12,98.42 72.39,99.69 130.18,99.69 132.72,97.16 132.72,52.07 123.83,43.18 89.54,43.18 88.9,43.81 88.9,56.52 87.63,57.78 Q1.13
GATE4
  Top 0.305: Q1.19 95.25,59.05 93.98,60.33 93.98,64.77 93.34,65.41 76.84,65.41 73.66,62.23 68.58,62.23 58.42,72.39 58.42,75.56 56.52,77.47 52.07,77.47 50.16,79.38 50.16,88.27 57.15,95.25 J5.3
GATE5
  Top 0.305: J6.3 43.18,79.38 45.72,76.83 55.88,76.83 57.78,74.93 57.78,71.75 67.95,61.59 74.3,61.59 77.47,64.77 92.08,64.77 92.71,64.14 Q1.11
GATE6
  Top 0.305: Q1.18 92.71,56.52 91.44,57.78 91.44,63.5 90.81,64.14 78.11,64.14 74.93,60.96 67.31,60.96 57.15,71.12 57.15,74.3 55.24,76.2 45.09,76.2 42.54,78.74 42.54,92.71 41.91,93.34 29.85,93.34 29.21,93.98 J7.3
GATE7
  Top 0.305: J8.3 15.24,92.71 15.88,92.08 41.27,92.08 41.91,91.44 41.91,78.11 44.45,75.56 54.61,75.56 56.52,73.66 56.52,70.48 66.67,60.33 75.56,60.33 77.47,62.23 Q1.14
GATE_B
  Top 0.61: Q6.7 115.57,33.66 R4.1
GND  (via drill 0.6)
  Top 0.305: C5.2 R3.1 C12.2 | Q10.4 57.15,49.53 v57.78,50.16 v59.05,50.16 | C27.2 R21.1 v67.95,67.31 v67.95,69.85 69.85,69.85 | 92.08,33.66 93.34,33.66 v93.98,33.02 | Q9.5 92.08,33.15 C14.2 | 104.91,47.62 C12.2 | C17.2 105.54,48.26 C12.2 | C19.1 104.14,40.13 P1.1
  Top 0.406: C14.2 92.08,33.66 | C26.2 v44.45,41.27
  Top 0.61: C2.1 C1.1 97.66,73.79 97.16,74.3 v96.52,74.3 v95.25,74.3 94.62,73.66 94.62,72.39 | C4.2 C5.2 v100.33,46.35 v99.06,46.35 v97.79,46.35 97.79,48.26 100.33,48.26 | 100.97,31.11 v100.33,30.48 | 100.97,31.11 v100.33,31.75 | Q6.4 100.97,31.11 | C6.2 C3.1 v104.14,72.39 v105.41,72.39 v106.68,72.39 106.68,69.85 104.14,69.85 | Q10.4 57.28,49.53 C21.2 | Q11.4 55.88,64.77 56.52,65.41 v57.78,65.41 58.42,65.41 | v59.05,65.41 58.42,65.41 | 58.42,65.41 C20.2 | C25.2 33.02,76.83 | 33.02,76.83 C22.2 | Q13.2 33.02,76.83 | Q12.2 9.53,78.11 10.16,77.47 | 10.16,77.47 C24.2 | 10.16,77.47 C23.2 | Q20.2 Q20.7 45.09,40.13 C26.2 | C7.1 89.16,87.12 v88.9,86.87
  other vias: 97.79,74.3
  pour Bottom: 0,0 134.62,0 134.62,101.6 0,101.6
IN
  Top 0.305: R19.2 74.3,9.53 78.74,5.08 113.03,5.08 113.03,11.43
  Top 0.61: Q3.2 Q3.4 118.75,12.7 125.73,12.7 C8.P$1 C9.P$1
  Top 0.813: J10.P$2 118.75,36.83 118.75,12.7
  pour Top: 109.22,21.59 107.95,20.32 107.95,5.08 109.22,3.81 128.27,3.81 129.54,5.08 129.54,38.1 128.27,39.37 119.38,39.37 118.11,38.1 118.11,22.86 116.84,21.59
INT_BAT
  Top 0.813: Q7.4 Q7.2
  pour Top: 25.4,71.12 21.59,71.12 20.96,70.48 20.96,43.81 21.59,43.18 33.66,43.18 34.29,43.81 34.29,70.48 33.66,71.12
  pour Top: 33.66,71.12 34.29,70.48 34.29,63.5 34.92,62.87 40.64,62.87 41.27,62.23 41.27,60.96 41.91,60.33 43.81,60.33 44.45,59.69 44.45,55.88 43.81,55.24 34.92,55.24 34.29,54.61 34.29,43.81 33.66,43.18 19.68,43.18 18.41,44.45 18.41,53.98 19.68,55.24 19.68,69.85 20.96,71.12
IP-
  Top 0.406: L1.1 88.27,17.78 Q9.1 Q9.2
  pour Top: 78.74,20.32 80.01,21.59 87.63,21.59 88.9,20.32 88.9,16.51 78.74,16.51
  pour Top: 77.47,20.32 85.09,27.94 88.9,27.94 88.9,13.97 87.63,12.7 78.74,12.7 77.47,13.97
MAIN
  Top 0.61: 38.42,29.21 59.05,29.21 78.74,48.9 R2.2
  Top 0.813: C10.P$1 46.86,9.48 L1.2 34.92,17.78 C11.P$1 27.3,20.91 D4.C
  pour Top: 1.27,40.64 2.54,41.91 26.67,41.91 27.94,40.64 27.94,31.75 29.21,30.48 48.26,30.48 49.53,29.21 49.53,5.08 48.26,3.81 2.54,3.81 1.27,5.08
  pour Top: 43.18,30.48 43.18,27.94 26.04,27.94
  pour Top: 27.94,36.83 30.48,34.29 40.64,34.29 41.91,33.02 41.91,29.21 26.67,29.21 26.67,36.83
MAINCURRENT
  Top 0.305: R9.2 94.62,45.72 95.25,45.09 108.59,45.09 109.22,45.72 109.22,53.34 Q1.24
N$2
  Top 0.61: 93.98,68.68 X1.P$1 | X1.P$1 94.08,68.48 95.25,67.31 Q1.10 | C2.2 91.95,70.72 X1.P$1
N$3
  Top 0.61: Q1.9 97.79,67.41 X1.P$2 | 99.06,68.68 X1.P$2 | C1.2 100.46,70.08 X1.P$2
N$4
  Top 0.254: 50.16,43.18 56.52,43.18 57.15,43.81
  Top 0.305: Q20.5 47.62,42.55 48.26,43.18 50.16,43.18
  Top 0.406: R14.1 71.12,45.72 69.22,43.81 57.15,43.81
N$5
  Top 0.254: Q4.10 63.5,89.53 64.14,88.9 103.51,88.9 106.05,91.44
  Top 0.305: 106.05,91.44 107.31,92.71 123.19,92.71 125.09,90.81 R17.2
N$6
  Top 0.61: C5.1 Q1.21
N$7
  Top 0.254: R18.2 127.64,92.08 126.37,93.34 92.08,93.34 90.81,92.08 62.86,92.08 Q4.11
N$8
  Top 0.61: Q1.1 118.82,62.23 J1.P$2 123.77,67.18 R1.2
N$9
  Top 0.254: Q9.7 89.54,31.75 90.17,32.38 90.17,35.56 R10.1
N$11
  Top 0.305: R19.1 74.3,52.07 73.03,53.34 R20.2
N$12
  Top 0.61: R15.SENSE2 43.61,37.96 Q20.8
N$13
  Top 0.61: R15.SENSE1 43.61,33.16 Q20.1
N$14
  Top 0.406: R9.1 77.47,45.72 71.12,39.37 R14.2
N$15
  Top 0.305: 110.62,48.77 C17.1 113.8,51.44 R7.2
  Top 0.406: 110.62,48.77 110.62,54.48 Q1.25
N$16
  Top 0.305: Q1.12 90.17,57.78 91.44,56.52 91.44,45.09 92.08,44.45 120.65,44.45 R8.2
N$21
  Top 0.61: Q1.2 115.57,63.5 113.03,66.04 Q2.2
N$22
  Top 0.61: Q2.3 114.3,68.58 111.76,68.58 111.76,64.77 113.03,63.5 Q1.3
N$31
  Top 0.61: Q3.1 R4.2
N$32
  Top 0.305: J13.1 118.75,77.97 R5.2
  Top 0.61: Q2.5 118.11,77.34 R5.2
N$33
  Top 0.305: J13.2 117.48,79.5 R5.1
  Top 0.61: Q2.6 115.57,77.34 R5.1
N$36
  Top 0.305: J13.6 112.4,78.23 R6.2
  Top 0.61: Q2.7 113.03,77.34 R6.2
N$37
  Top 0.305: J13.3 116.2,83.82 115.57,84.45 109.86,84.45 108.59,83.19 108.59,78.74 109.86,77.47 R6.1
  Top 0.61: Q2.8 110.49,77.34 R6.1
PANIC
  Top 0.305: Q1.27 117.16,56.2 R12.1 123.32,55.88 J12.2
QBATTERY1
  Top 0.61: Q10.7 Q8.1
QBATTERY2
  Top 0.61: Q11.7 Q7.1
S1_HIGH
  Top 0.61: C15.1 46.35,45.72 Q10.8 50.8,45.72 51.43,46.35 51.43,57.15 50.8,57.78 48.26,57.78 47.62,57.15 P2.4
S2_HIGH
  Top 0.61: C16.1 46.48,60.96 Q11.8 50.8,60.96 51.43,61.59 51.43,74.3 49.01,74.3 P3.4
S_BATTERY
  Top 0.61: Q1.15 67.31,54.61 | 67.31,54.61 63.5,50.8 63.5,48.26 62.23,46.99 Q10.2 | Q11.2 62.23,62.23 63.5,60.96 63.5,58.42 67.31,54.61
S_BUCK
  Top 0.305: Q6.2 99.27,33.66 99.06,33.86 99.06,34.29 97.16,36.2 92.71,36.2 87.63,41.27 Q1.16
TEMP  (via drill 0.46)
  Top 0.254: v75.56,72.39 82.55,72.39 82.55,82.55 88.27,88.27 93.34,88.27 93.34,86.36
  Top 0.305: 93.34,86.36 126.37,86.36 130.18,82.55 130.18,56.52 128.27,54.61 Q1.28
  Bottom 0.254: Q4.17 74.93,72.39 v75.56,72.39
TEMP1  (via drill 0.46)
  Top 0.254: Q4.23 84.45,79.38 84.45,83.19 v87.63,86.36 | v93.98,90.17 96.52,90.17 v96.52,92.08 | J2.4 v99.7,95.25
  Bottom 0.254: v87.63,86.36 88.27,85.72 89.54,85.72 v93.98,90.17 | v99.7,95.25 v96.52,92.08
TEMP2  (via drill 0.46)
  Top 0.254: Q4.22 81.92,79.38 81.92,83.82 v85.73,87.63
  Bottom 0.254: v85.73,87.63 87.63,89.53 J3.4
TEMP3  (via drill 0.46)
  Top 0.254: v78.74,87.63 Q4.21
  Bottom 0.254: v78.74,87.63 77.47,88.9 77.47,97.16 76.84,97.79 75.56,97.79 74.3,96.52 J4.4
TEMP4
  Top 0.254: Q4.20 68.58,86.36 59.69,86.36 J5.4
TEMP5  (via drill 0.46)
  Top 0.254: Q4.19 72.39,77.47 59.69,77.47 59.69,81.92 54.61,87 v54.61,91.44 | v50.16,96.52 48.89,97.79 45.72,97.79 J6.4
  Bottom 0.254: v54.61,91.44 50.16,95.89 v50.16,96.52
TEMP6
  Top 0.254: Q4.18 64.14,85.72 57.15,85.72 57.15,93.98 58.42,95.25 58.42,97.16 57.78,97.79 55.88,97.79 55.88,95.89 55.24,95.25 44.45,95.25 44.45,97.16 43.81,97.79 41.91,97.79 41.91,95.89 41.27,95.25 31.75,95.25 J7.4
TEMP7  (via drill 0.46)
  Top 0.254: Q4.16 60.32,84.45 v58.42,84.45 | v57.15,83.19 51.43,83.19 v51.43,88.27 | v50.16,89.53 44.45,89.53 v44.45,92.08 | v41.91,94.61 30.48,94.61 30.48,97.16 29.85,97.79 27.94,97.79 27.94,95.89 27.3,95.25 17.78,95.25 J8.4
  Bottom 0.254: v57.15,83.19 v58.42,84.45 | v50.16,89.53 v51.43,88.27 | v41.91,94.61 v44.45,92.08
TEMP8  (via drill 0.46)
  Top 0.254: v64.77,75.56 Q5.2
  Bottom 0.254: v64.77,75.56 64.77,77.47 Q4.15
V_MAIN
  Top 0.305: R2.1 94.62,48.9 95.25,49.53 101.6,49.53 102.87,50.8 105.28,50.8 C12.1
  Top 0.61: R3.2 C12.1 Q1.23
VB
  Top 0.61: Q6.8 112.4,34.92 C13.1 P1.4
VIN  (via drill 0.46)
  Top 0.254: v81.28,87.63 80.01,86.36 80.01,78.11 73.03,71.12 73.03,69.85 C27.1
  Top 0.305: R20.1 72.39,67.18 R21.2 C27.1
  Bottom 0.254: v81.28,87.63 Q4.2
VOLTS  (via drill 0.46, 0.6)
  Top 0.254: Q4.1 92.08,90.17 v92.08,92.08 | 85.09,93.98 v91.44,93.98
  Top 0.305: Q1.26 113.03,52.7 117.48,52.7 118.75,51.44 129.54,51.44 131.44,53.34 131.44,95.89 128.91,98.42 87,98.42 86.36,97.79 86.36,95.25 85.09,93.98 v84.45,93.34
  Bottom 0.254: v92.08,92.08 92.08,93.34 v91.44,93.98
VOLTS1  (via drill 0.46)
  Top 0.254: v69.85,86.36 71.12,86.36 v76.2,81.28 | v89.54,83.82 v86.36,80.64 | J2.5 v102.23,95.25
  Bottom 0.254: v69.85,86.36 Q4.9 | v76.2,81.28 76.84,80.64 v86.36,80.64 | v89.54,83.82 100.97,95.25 v102.23,95.25
VOLTS2  (via drill 0.46)
  Top 0.254: v76.2,86.36 v72.39,86.36 | v81.28,86.36 83.19,86.36 v84.45,87.63
  Bottom 0.254: v72.39,86.36 Q4.8 | v76.2,86.36 76.84,85.72 80.65,85.72 v81.28,86.36 | v84.45,87.63 85.73,86.36 90.17,90.81 J3.5
VOLTS3  (via drill 0.46)
  Top 0.254: J4.5 v74.93,95.25
  Bottom 0.254: Q4.7 74.93,93.98 v74.93,95.25
VOLTS4  (via drill 0.46)
  Top 0.254: Q4.6 72.39,91.44 67.31,91.44 v67.31,90.81
  Bottom 0.254: v67.31,90.81 62.23,95.89 J5.5
VOLTS5  (via drill 0.46)
  Top 0.254: v60.96,87.63 v73.66,87.63
  Bottom 0.254: v73.66,87.63 Q4.5 | v60.96,87.63 60.32,88.27 56.52,88.27 J6.5
VOLTS6  (via drill 0.46)
  Top 0.254: Q4.4 80.01,90.17 v80.01,90.81 | v78.11,98.42 72.39,98.42 72.39,95.89 71.76,95.25 v69.85,95.25 | v60.96,94.61 v67.31,94.61 | v44.45,93.98 v54.61,93.98 | J7.5 v36.2,96.52
  Bottom 0.254: v80.01,90.81 80.01,93.34 78.11,95.25 v78.11,98.42 | v69.85,95.25 69.22,94.61 v67.31,94.61 | v60.96,94.61 60.32,93.98 v54.61,93.98 | v44.45,93.98 43.18,95.25 42.54,95.25 41.91,95.89 40.64,94.61 37.46,94.61 36.2,95.89 v36.2,96.52
VOLTS7  (via drill 0.46)
  Top 0.254: v77.47,87 77.47,76.83 v74.93,74.3 | v60.32,71.75 v71.76,71.75 | v57.15,68.58 53.97,71.75 53.97,73.66 52.7,74.93 43.81,74.93 41.27,77.47 41.27,90.81 40.64,91.44 15.24,91.44 13.97,92.71 13.97,97.16 14.61,97.79 20.32,97.79 J8.5
  Bottom 0.254: Q4.3 80.01,88.9 80.01,87.63 78.74,86.36 78.11,86.36 v77.47,87 | v74.93,74.3 76.84,72.39 74.3,69.85 73.66,69.85 v71.76,71.75 | v57.15,68.58 v60.32,71.75
VS
  Top 0.254: Q3.3 110.74,27.43 110.49,27.3
  Top 0.406: Q9.3 Q9.4
  Top 0.61: C13.2 112.4,32.38 Q6.6 106.05,32.38 | C13.2 110.49,32.26 110.49,27.3 106.05,27.3 | C13.2 112.4,31.75 | P1.3 109.86,37.47 109.23,36.83 106.68,36.83 106.05,36.2 106.05,32.38 | 106.05,32.38 106.05,27.3 | 106.05,27.3 106.05,22.86 100.33,22.86 | 91.57,21.72 92.71,22.86 100.33,22.86 | D1.4 100.33,22.86 | D1.2 100.33,22.86
  pour Top: 91.44,24.13 91.44,7.62 92.71,6.35 104.14,6.35 105.41,7.62 105.41,21.59 106.68,22.86 110.49,22.86 111.76,24.13 111.76,27.94 110.49,29.21 106.68,29.21 105.41,27.94 105.41,26.67 104.14,25.4 92.71,25.4
  pour Top: 96.52,25.4 93.98,27.94 91.44,27.94 91.44,17.78 92.71,16.51 96.52,16.51

### Text on the board
tPlace: REV C | MRDT BPS MAIN | + | E-STOP | BATTERY | POWER BOARD | Charger | + | + | Today, Tomorrow, Forever
Drill_legend: Drill legend | Date: 2/20/2014 10:00:39 AM | 3.5560 mm / 140.000 mil count= 3 | 3.2000 mm / 125.984 mil count= 2 | 2.0000 mm / 78.740 mil count= 2 | 1.6000 mm / 62.992 mil count= 8 | 1.5000 mm / 59.055 mil count= 2 | 1.4000 mm / 55.118 mil count= 14 | 1.3970 mm / 55.000 mil count= 8 | 1.1430 mm / 45.000 mil count= 37 | 1.0000 mm / 39.370 mil count= 8 | 0.8636 mm / 34.000 mil count= 60 | 0.8128 mm / 32.000 mil count= 24 | 0.7000 mm / 27.559 mil count= 18 | 0.6270 mm / 24.685 mil count= 12 | 0.6000 mm / 23.622 mil count= 24 | 0.5500 mm / 21.654 mil count= 3 | 0.5000 mm / 19.685 mil count= 2 | 0.4572 mm / 18.000 mil count= 54